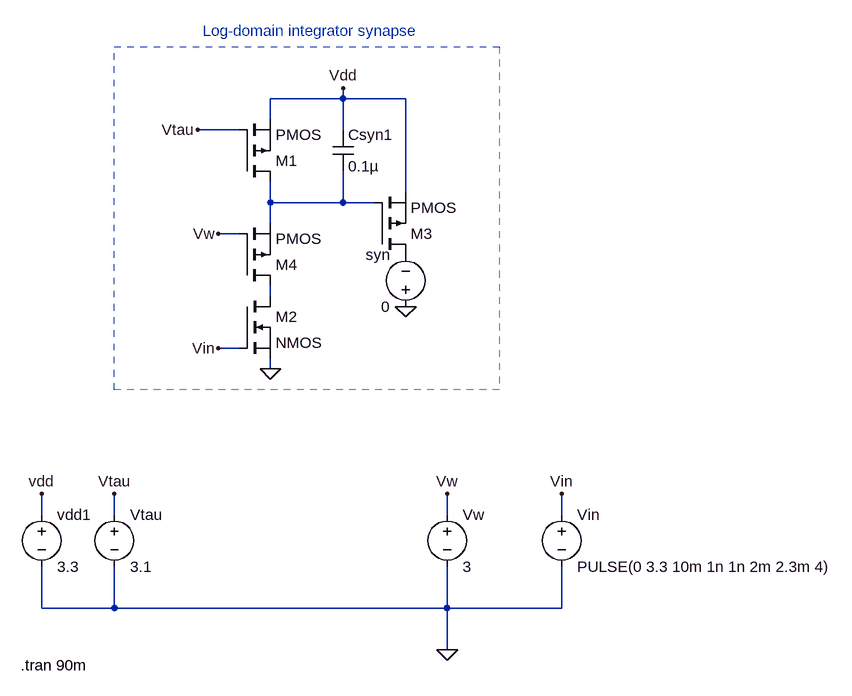
[diagram p0: schematic LogDomainIntegrator_working.asc]
LogDomainIntegrator_working.asc, the LTspice schematic file:
Version 4.1
SHEET 1 928 840
WIRE 128 -48 128 -64
WIRE 128 -48 16 -48
WIRE 224 -48 128 -48
WIRE 16 -16 16 -48
WIRE -32 0 -96 0
WIRE 128 0 128 -48
WIRE 224 96 224 -48
WIRE 16 112 16 80
WIRE 128 112 128 64
WIRE 128 112 16 112
WIRE 176 112 128 112
WIRE 16 144 16 112
WIRE -32 160 -64 160
WIRE 16 256 16 240
WIRE -32 336 -64 336
WIRE 16 368 16 352
WIRE -336 592 -336 560
WIRE -224 592 -224 560
WIRE 288 592 288 560
WIRE 464 592 464 560
WIRE -336 736 -336 672
WIRE -224 736 -224 672
WIRE -224 736 -336 736
WIRE 288 736 288 672
WIRE 288 736 -224 736
WIRE 464 736 464 672
WIRE 464 736 288 736
WIRE 288 800 288 736
FLAG -64 336 Vin
FLAG -64 160 Vw
FLAG -96 0 Vtau
FLAG 128 -64 Vdd
FLAG 16 368 0
FLAG 464 560 Vin
FLAG 288 560 Vw
FLAG -224 560 Vtau
FLAG 288 800 0
FLAG -336 560 vdd
FLAG 224 272 0
SYMBOL cap 112 0 R0
SYMATTR InstName Csyn1
SYMATTR Value 0.1µ
SYMBOL pmos -32 80 M180
SYMATTR InstName M1
SYMBOL nmos -32 256 R0
SYMATTR InstName M2
SYMBOL pmos 176 192 M180
SYMATTR InstName M3
SYMBOL pmos -32 240 M180
SYMATTR InstName M4
SYMBOL voltage 464 576 R0
WINDOW 123 0 0 Left 0
WINDOW 39 0 0 Left 0
SYMATTR InstName Vin
SYMATTR Value PULSE(0 3.3 10m 1n 1n 2m 2.3m 4)
SYMBOL voltage 288 576 R0
WINDOW 123 0 0 Left 0
WINDOW 39 0 0 Left 0
SYMATTR InstName Vw
SYMATTR Value 3
SYMBOL voltage -224 576 R0
WINDOW 123 0 0 Left 0
WINDOW 39 0 0 Left 0
SYMATTR InstName Vtau
SYMATTR Value 3.1
SYMBOL voltage -336 576 R0
SYMATTR InstName vdd1
SYMATTR Value 3.3
SYMBOL voltage 224 288 R180
WINDOW 0 24 96 Left 2
WINDOW 3 24 16 Left 2
SYMATTR InstName syn
SYMATTR Value 0
TEXT -88 -152 Left 2 ;Log-domain integrator synapse
TEXT -368 824 Left 2 !.tran 90m
RECTANGLE Normal 368 400 -224 -128 2

The netlist it stands for:
* LogDomainIntegrator_working.asc
Csyn1 Vdd N001 0.1µ
M1 N001 Vtau Vdd Vdd PMOS
M2 N002 Vin 0 0 NMOS
M3 P001 N001 Vdd Vdd PMOS
M4 N002 Vw N001 N001 PMOS
Vin Vin 0 PULSE(0 3.3 10m 1n 1n 2m 2.3m 4)
Vw Vw 0 3
Vtau Vtau 0 3.1
vdd1 Vdd 0 3.3
V§syn 0 P001 0
.model NMOS NMOS
.model PMOS PMOS
.lib standard.mos
* Log-domain integrator synapse
.tran 90m
.backanno
.end